# EAGLE design mainboard (EAGLE 7.7.0)
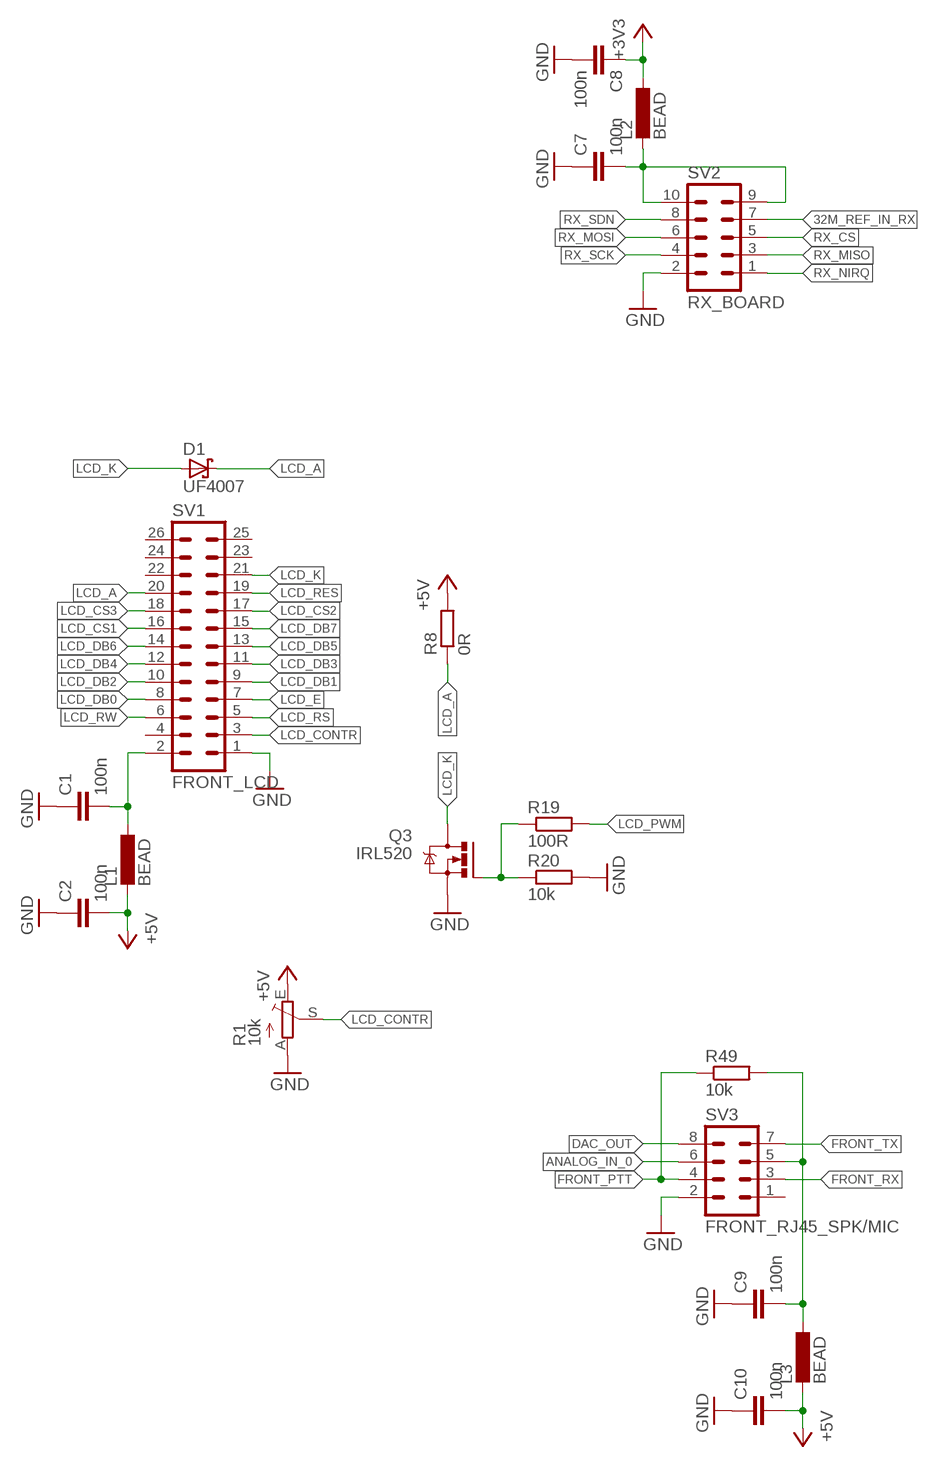
[diagram p0: schematic, sheet 1, part 1 of 3]
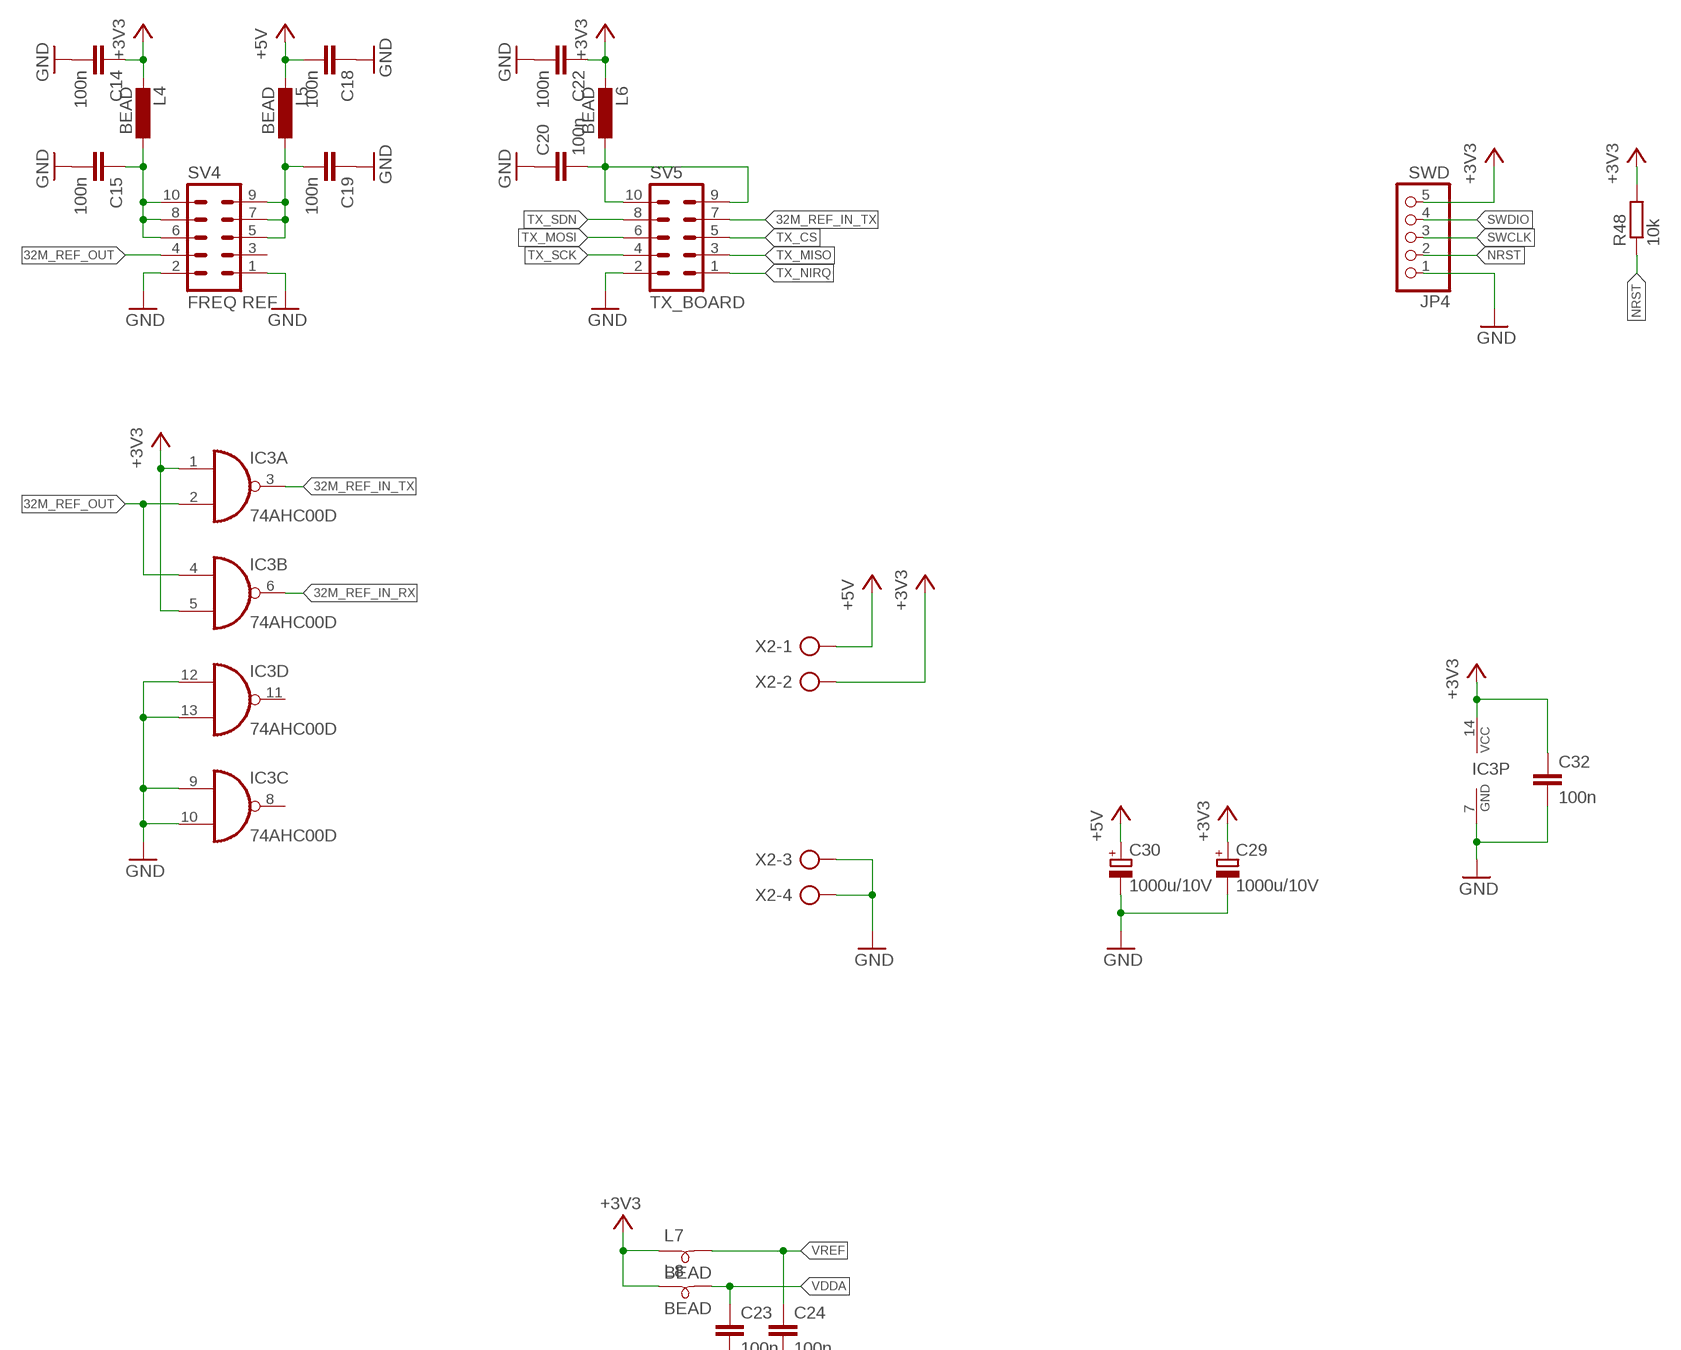
[diagram p1: schematic, sheet 1, part 2 of 3]
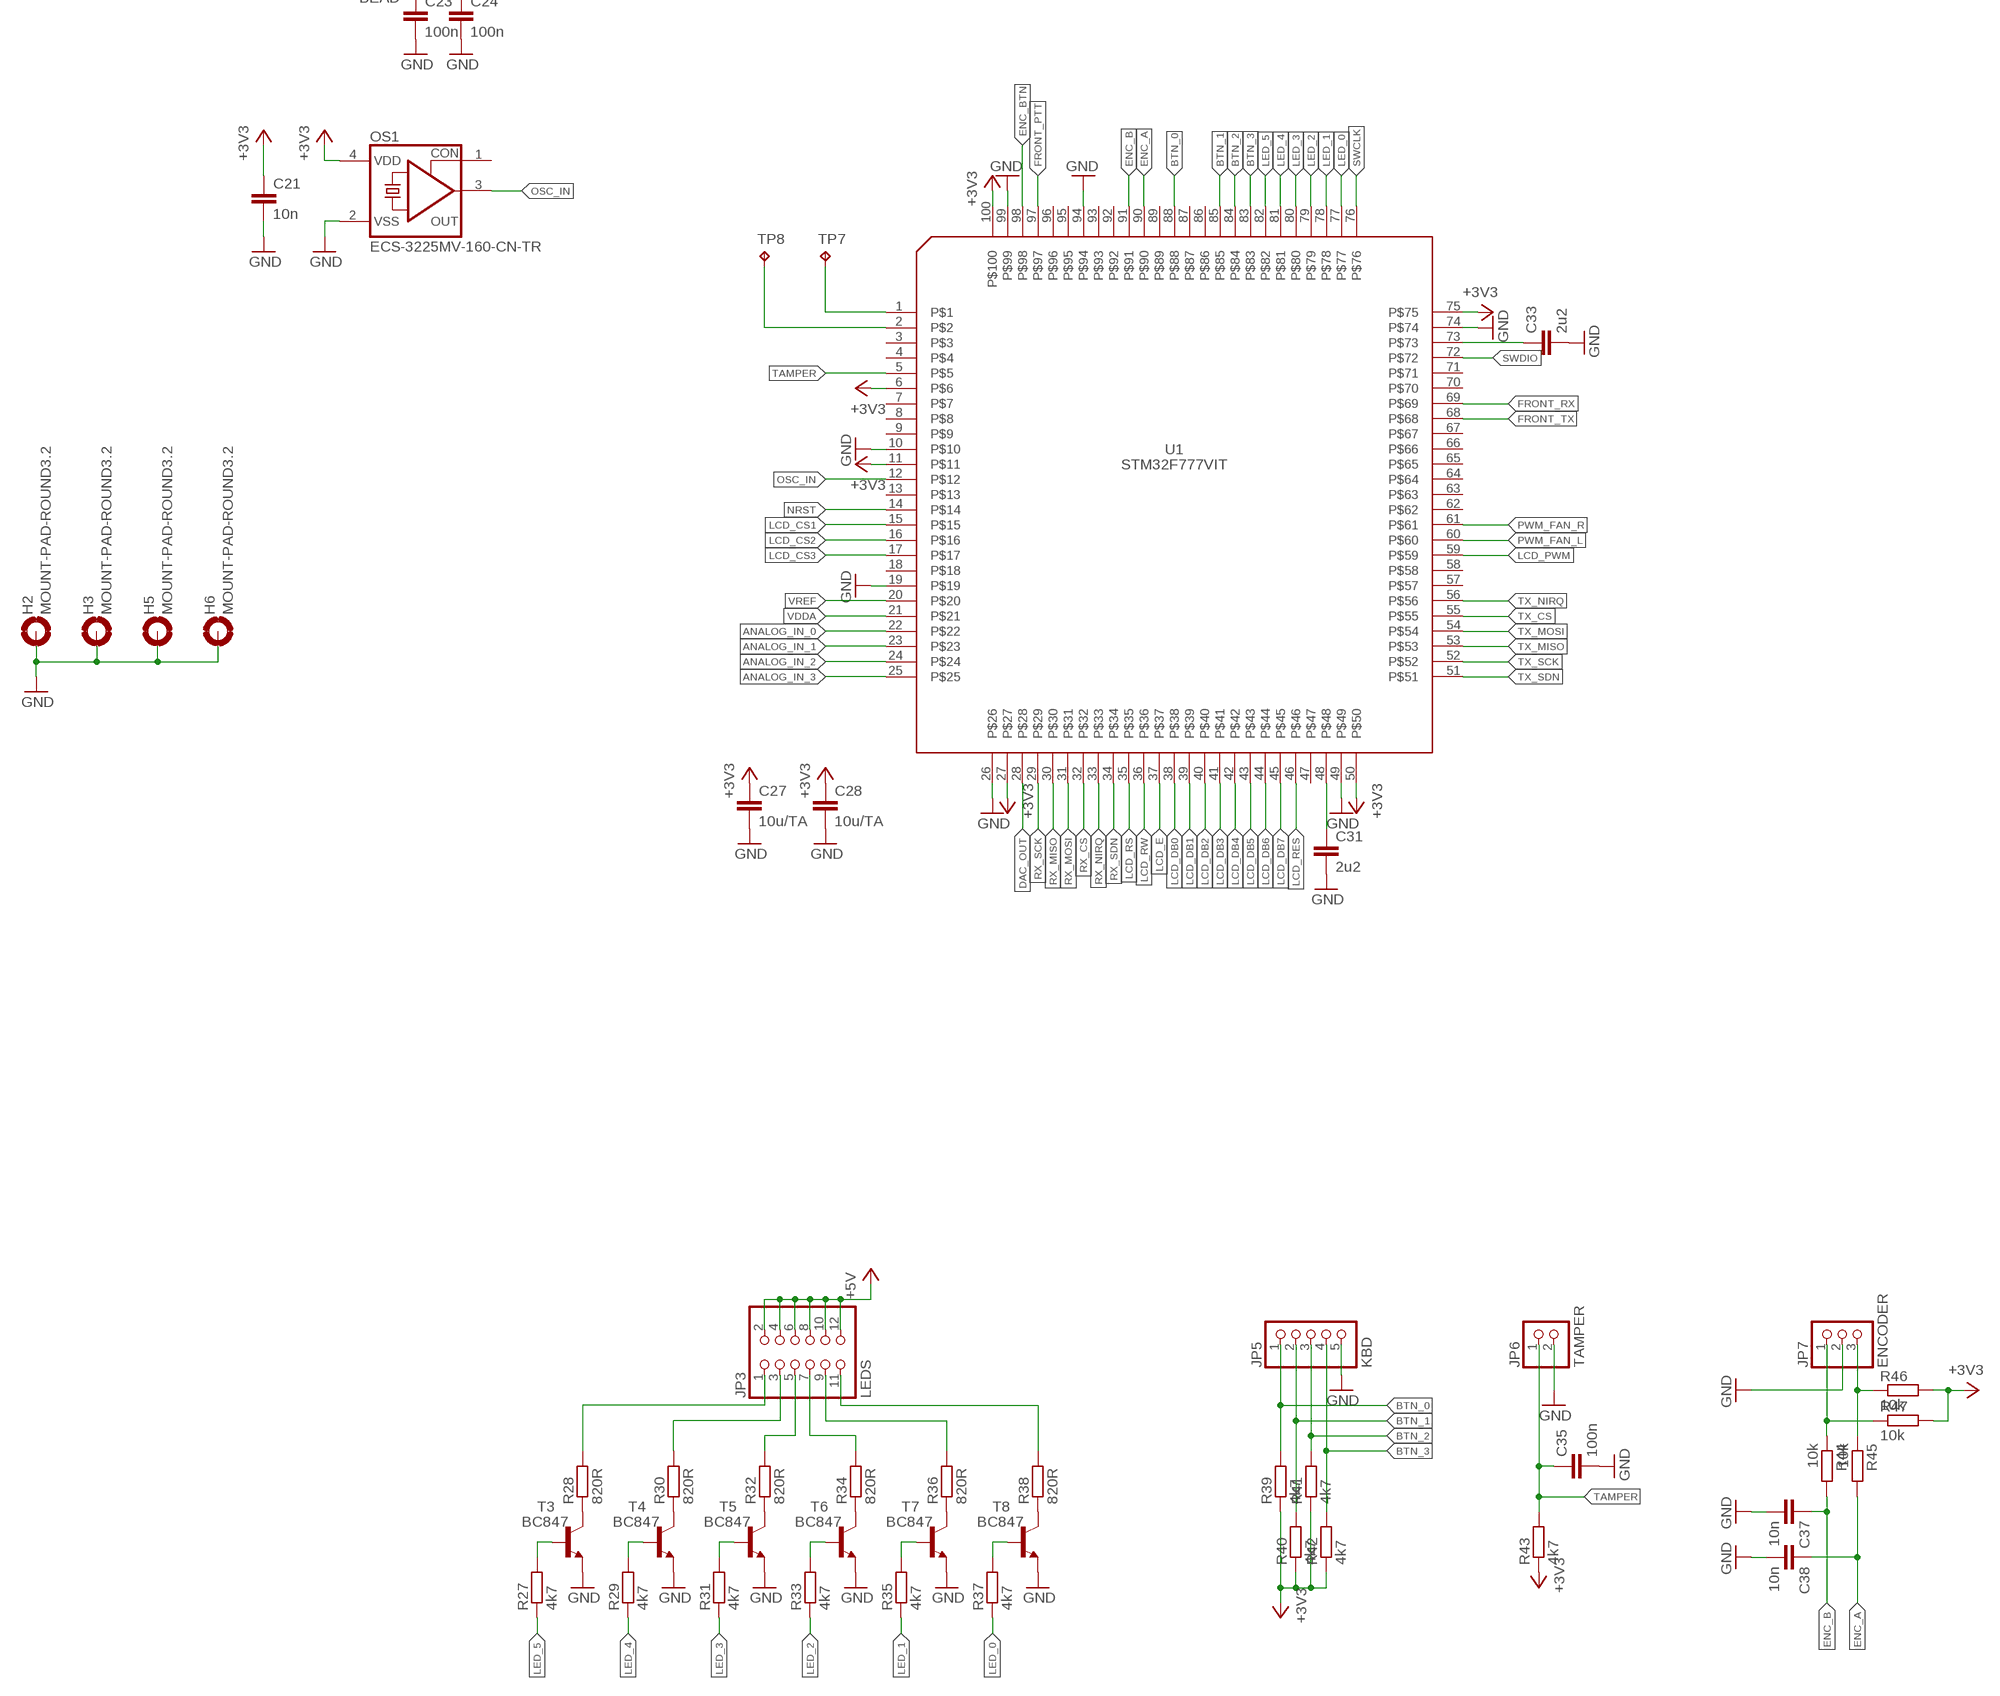
[diagram p2: schematic, sheet 1, part 3 of 3]

## Parts
C1  100n  C-EUC0805  [C0805]
C2  100n  C-EUC0805  [C0805]
C7  100n  C-EUC0805  [C0805]
C8  100n  C-EUC0805  [C0805]
C9  100n  C-EUC0805  [C0805]
C10  100n  C-EUC0805  [C0805]
C14  100n  C-EUC0805  [C0805]
C15  100n  C-EUC0805  [C0805]
C18  100n  C-EUC0805  [C0805]
C19  100n  C-EUC0805  [C0805]
C20  100n  C-EUC0805  [C0805]
C21  10n  C-EUC0805  [C0805]
C22  100n  C-EUC0805  [C0805]
C23  100n  C-EUC0805  [C0805]
C24  100n  C-EUC0805  [C0805]
C27  10u/TA  C-EUC1206  [C1206]
C28  10u/TA  C-EUC1206  [C1206]
C29  1000u/10V  CPOL-EUE3.5-8  [E3,5-8]
C30  1000u/10V  CPOL-EUE3.5-8  [E3,5-8]
C31  2u2  C-EUC0805  [C0805]
C32  100n  C-EUC0805  [C0805]
C33  2u2  C-EUC0805  [C0805]
C35  100n  C-EUC0805  [C0805]
C37  10n  C-EUC0805  [C0805]
C38  10n  C-EUC0805  [C0805]
D1  UF4007  1N5819-T  [DO41-7.6]
H2  MOUNT-PAD-ROUND3.2  [3,2-PAD]
H3  MOUNT-PAD-ROUND3.2  [3,2-PAD]
H5  MOUNT-PAD-ROUND3.2  [3,2-PAD]
H6  MOUNT-PAD-ROUND3.2  [3,2-PAD]
IC3  74AHC00D  7400D  [SO14]
JP3  LEDS  PINHD-2X6  [2X06]
JP4  SWD  PINHD-1X5  [1X05]
JP5  KBD  PINHD-1X5  [1X05]
JP6  TAMPER  PINHD-1X2  [1X02]
JP7  ENCODER  PINHD-1X3  [1X03]
L1  BEAD  L-EU0204/7  [0204/7]
L2  BEAD  L-EU0204/7  [0204/7]
L3  BEAD  L-EU0204/7  [0204/7]
L4  BEAD  L-EU0204/7  [0204/7]
L5  BEAD  L-EU0204/7  [0204/7]
L6  BEAD  L-EU0204/7  [0204/7]
L7  BEAD  SM-B5  [SM-B5]
L8  BEAD  SM-B5  [SM-B5]
OS1  ECS-3225MV-160-CN-TR  OSC-OE-CFPS-39  [3.4X2.7-4-PAD]
Q3  IRL520  IRF540  [TO220BV]
R1  10k  TRIM_EU-CA6V  [CA6V]
R8  0R  R-EU_R1206  [R1206]
R19  100R  R-EU_R0805  [R0805]
R20  10k  R-EU_R0805  [R0805]
R27  4k7  R-EU_R0805  [R0805]
R28  820R  R-EU_R0805  [R0805]
R29  4k7  R-EU_R0805  [R0805]
R30  820R  R-EU_R0805  [R0805]
R31  4k7  R-EU_R0805  [R0805]
R32  820R  R-EU_R0805  [R0805]
R33  4k7  R-EU_R0805  [R0805]
R34  820R  R-EU_R0805  [R0805]
R35  4k7  R-EU_R0805  [R0805]
R36  820R  R-EU_R0805  [R0805]
R37  4k7  R-EU_R0805  [R0805]
R38  820R  R-EU_R0805  [R0805]
R39  4k7  R-EU_R0805  [R0805]
R40  4k7  R-EU_R0805  [R0805]
R41  4k7  R-EU_R0805  [R0805]
R42  4k7  R-EU_R0805  [R0805]
R43  4k7  R-EU_R0805  [R0805]
R44  10k  R-EU_R0805  [R0805]
R45  10k  R-EU_R0805  [R0805]
R46  10k  R-EU_R0805  [R0805]
R47  10k  R-EU_R0805  [R0805]
R48  10k  R-EU_R0805  [R0805]
R49  10k  R-EU_R0805  [R0805]
SV1  FRONT_LCD  ML26  [ML26]
SV2  RX_BOARD  ML10  [ML10]
SV3  FRONT_RJ45_SPK/MIC  MA04-2  [MA04-2]
SV4  FREQ REF  ML10  [ML10]
SV5  TX_BOARD  ML10  [ML10]
T3  BC847  [SOT23]
T4  BC847  [SOT23]
T5  BC847  [SOT23]
T6  BC847  [SOT23]
T7  BC847  [SOT23]
T8  BC847  [SOT23]
TP7  TPB2,54  [B2,54]
TP8  TPB2,54  [B2,54]
U1  STM32F777VIT  [LQFP100]
X2  AK500/4  [AK500/4]

## Nets
32M_REF_IN_RX: IC3.6(B:O) SV2.7
32M_REF_IN_TX: IC3.3(A:O) SV5.7
32M_REF_OUT: IC3.2(A:I1) IC3.4(B:I0) SV4.4
+3V3: C8.1 C14.1 C21.1 C22.1 C27.1 C28.1 C29.+ C32.1 IC3.1(A:I0) IC3.5(B:I1) IC3.14(P:VCC) JP4.5 L2.1 L4.2 L6.2 L7.1 L8.1 OS1.4(VDD) R39.1 R40.1 R41.1 R42.1 R43.1 R46.2 R47.2 R48.2 U1.6 U1.11 U1.27 U1.50 U1.75 U1.100 X2.2
+5V: C2.2 C10.2 C18.2 C30.+ JP3.2 JP3.4 JP3.6 JP3.8 JP3.10 JP3.12 L1.2 L3.2 L5.2 R1.E R8.2 X2.1
ANALOG_IN_0: SV3.6 U1.22
ANALOG_IN_1: U1.23
ANALOG_IN_2: U1.24
ANALOG_IN_3: U1.25
BTN_0: JP5.1 R39.2 U1.88
BTN_1: JP5.2 R40.2 U1.85
BTN_2: JP5.3 R41.2 U1.84
BTN_3: JP5.4 R42.2 U1.83
DAC_OUT: SV3.8 U1.28
ENC_A: C38.1 R45.2 U1.90
ENC_B: C37.1 R44.2 U1.91
ENC_BTN: U1.98
FRONT_PTT: R49.1 SV3.4 U1.97
FRONT_RX: SV3.3 U1.69
FRONT_TX: SV3.7 U1.68
GND: C1.1 C2.1 C7.1 C8.2 C9.1 C10.1 C14.2 C15.2 C18.1 C19.1 C20.1 C21.2 C22.2 C23.2 C24.2 C27.2 C28.2 C29.- C30.- C31.2 C32.2 C33.2 C35.2 C37.2 C38.2 H2.B3,2(MOUNT) H3.B3,2(MOUNT) H5.B3,2(MOUNT) H6.B3,2(MOUNT) IC3.7(P:GND) IC3.9(C:I0) IC3.10(C:I1) IC3.12(D:I0) IC3.13(D:I1) JP4.1 JP5.5 JP6.2 JP7.2 OS1.2(VSS) Q3.S R1.A R20.2 SV1.1 SV2.2 SV3.2 SV4.1 SV4.2 SV5.2 T3.2(E) T4.2(E) T5.2(E) T6.2(E) T7.2(E) T8.2(E) U1.10 U1.19 U1.26 U1.49 U1.74 U1.94 U1.99 X2.3 X2.4
LCD_A: D1.C R8.1 SV1.20
LCD_CONTR: R1.S SV1.3
LCD_CS1: SV1.16 U1.15
LCD_CS2: SV1.17 U1.16
LCD_CS3: SV1.18 U1.17
LCD_DB0: SV1.8 U1.38
LCD_DB1: SV1.9 U1.39
LCD_DB2: SV1.10 U1.40
LCD_DB3: SV1.11 U1.41
LCD_DB4: SV1.12 U1.42
LCD_DB5: SV1.13 U1.43
LCD_DB6: SV1.14 U1.44
LCD_DB7: SV1.15 U1.45
LCD_E: SV1.7 U1.37
LCD_K: D1.A Q3.D SV1.21
LCD_PWM: R19.2 U1.59
LCD_RES: SV1.19 U1.46
LCD_RS: SV1.5 U1.35
LCD_RW: SV1.6 U1.36
LED_0: R37.1 U1.77
LED_1: R35.1 U1.78
LED_2: R33.1 U1.79
LED_3: R31.1 U1.80
LED_4: R29.1 U1.81
LED_5: R27.1 U1.82
N$2: Q3.G R19.1 R20.1
N$4: C15.1 L4.1 SV4.6 SV4.8 SV4.10
N$5: C19.2 L5.1 SV4.5 SV4.7 SV4.9
N$6: C20.2 L6.1 SV5.9 SV5.10
N$7: C1.2 L1.1 SV1.2
N$8: C7.2 L2.2 SV2.9 SV2.10
N$13: C9.2 L3.1 R49.2 SV3.5
N$24: C31.1 U1.48
N$25: C33.1 U1.73
N$28: R27.2 T3.1(B)
N$29: R28.1 T3.3(C)
N$30: JP3.1 R28.2
N$31: JP3.3 R30.2
N$32: R29.2 T4.1(B)
N$33: R30.1 T4.3(C)
N$34: JP3.5 R32.2
N$35: R31.2 T5.1(B)
N$36: R32.1 T5.3(C)
N$37: JP3.7 R34.2
N$38: R33.2 T6.1(B)
N$39: R34.1 T6.3(C)
N$40: JP3.9 R36.2
N$41: R35.2 T7.1(B)
N$42: R36.1 T7.3(C)
N$43: JP3.11 R38.2
N$44: R37.2 T8.1(B)
N$46: R38.1 T8.3(C)
N$47: TP7.TP U1.1
N$48: JP7.3 R45.1 R46.1
N$49: JP7.1 R44.1 R47.1
N$50: TP8.TP U1.2
NRST: JP4.2 R48.1 U1.14
OSC_IN: OS1.3(OUT) U1.12
PWM_FAN_L: U1.60
PWM_FAN_R: U1.61
RX_CS: SV2.5 U1.32
RX_MISO: SV2.3 U1.30
RX_MOSI: SV2.6 U1.31
RX_NIRQ: SV2.1 U1.33
RX_SCK: SV2.4 U1.29
RX_SDN: SV2.8 U1.34
SWCLK: JP4.3 U1.76
SWDIO: JP4.4 U1.72
TAMPER: C35.1 JP6.1 R43.2 U1.5
TX_CS: SV5.5 U1.55
TX_MISO: SV5.3 U1.53
TX_MOSI: SV5.6 U1.54
TX_NIRQ: SV5.1 U1.56
TX_SCK: SV5.4 U1.52
TX_SDN: SV5.8 U1.51
VDDA: C23.1 L8.2 U1.21
VREF: C24.1 L7.2 U1.20
Unconnected: IC3.8(C:O) IC3.11(D:O) OS1.1(CON) SV1.4 SV1.22 SV1.23 SV1.24 SV1.25 SV1.26 SV3.1 SV4.3 U1.3 U1.4 U1.7 U1.8 U1.9 U1.13 U1.18 U1.47 U1.57 U1.58 U1.62 U1.63 U1.64 U1.65 U1.66 U1.67 U1.70 U1.71 U1.86 U1.87 U1.89 U1.92 U1.93 U1.95 U1.96

## Library data of the parts
C1 C2 C7-C10 C14 C15 C18-C24 C31-C33 C35 C37 C38 = rcl:C-EU: CAPACITOR, European symbol
C27 C28 = resistor:C-EU: CAPACITOR, European symbol
C29 C30 = rcl:CPOL-EU: POLARIZED CAPACITOR, European symbol
D1 = diode:1N581*: 1.0A SCHOTTKY BARRIER RECTIFIER Source: http://www.diodes.com/datasheets/ds23001.pdf
H2 H3 H5 H6 = holes:MOUNT-PAD-ROUND: MOUNTING PAD, round
IC3 = 74xx-eu:74*00: Quad 2-input NAND gate
JP3 = pinhead:PINHD-2X6: PIN HEADER
JP4 JP5 = pinhead:PINHD-1X5: PIN HEADER
JP6 = pinhead:PINHD-1X2: PIN HEADER
JP7 = pinhead:PINHD-1X3: PIN HEADER
L1-L6 = rcl:L-EU: INDUCTOR, European symbol
L7 L8 = inductor-neosid:SM-B: INDUCTOR SMD Bead inductor; OC_FARNELL: unknown; OC_NEWARK: unknown
OS1 = IQD-Frequency-Products:OSC-OE: OSCILLATOR WITH OE
Q3 = transistor-power:IRF540: HEXFET Power MOSFET
R1 = pot:TRIM_EU-: POTENTIOMETER
R8 R44-R47 = rcl:R-EU_: RESISTOR, European symbol
R19 R20 R27-R43 R48 R49 = resistor:R-EU_: RESISTOR, European symbol
SV1 = con-harting-ml:ML26: HARTING; OC_FARNELL: unknown; OC_NEWARK: unknown
SV2 SV4 SV5 = con-harting-ml:ML10: HARTING; OC_FARNELL: unknown; OC_NEWARK: unknown
SV3 = con-lstb:MA04-2: PIN HEADER; OC_FARNELL: unknown; OC_NEWARK: unknown
T3-T8 = transistor:BC847: NPN TRANSISTOR
TP7 TP8 = testpad:TP: Test pad
U1 = micro-stm_v3:STM32F777VIT
X2 = con-ptr500:AK500/4: CONNECTOR; OC_FARNELL: unknown; OC_NEWARK: unknown

## Net classes
1 pwr: width 0.5 mm, drill 0.2 mm, clearance 0.127 mm

## Board
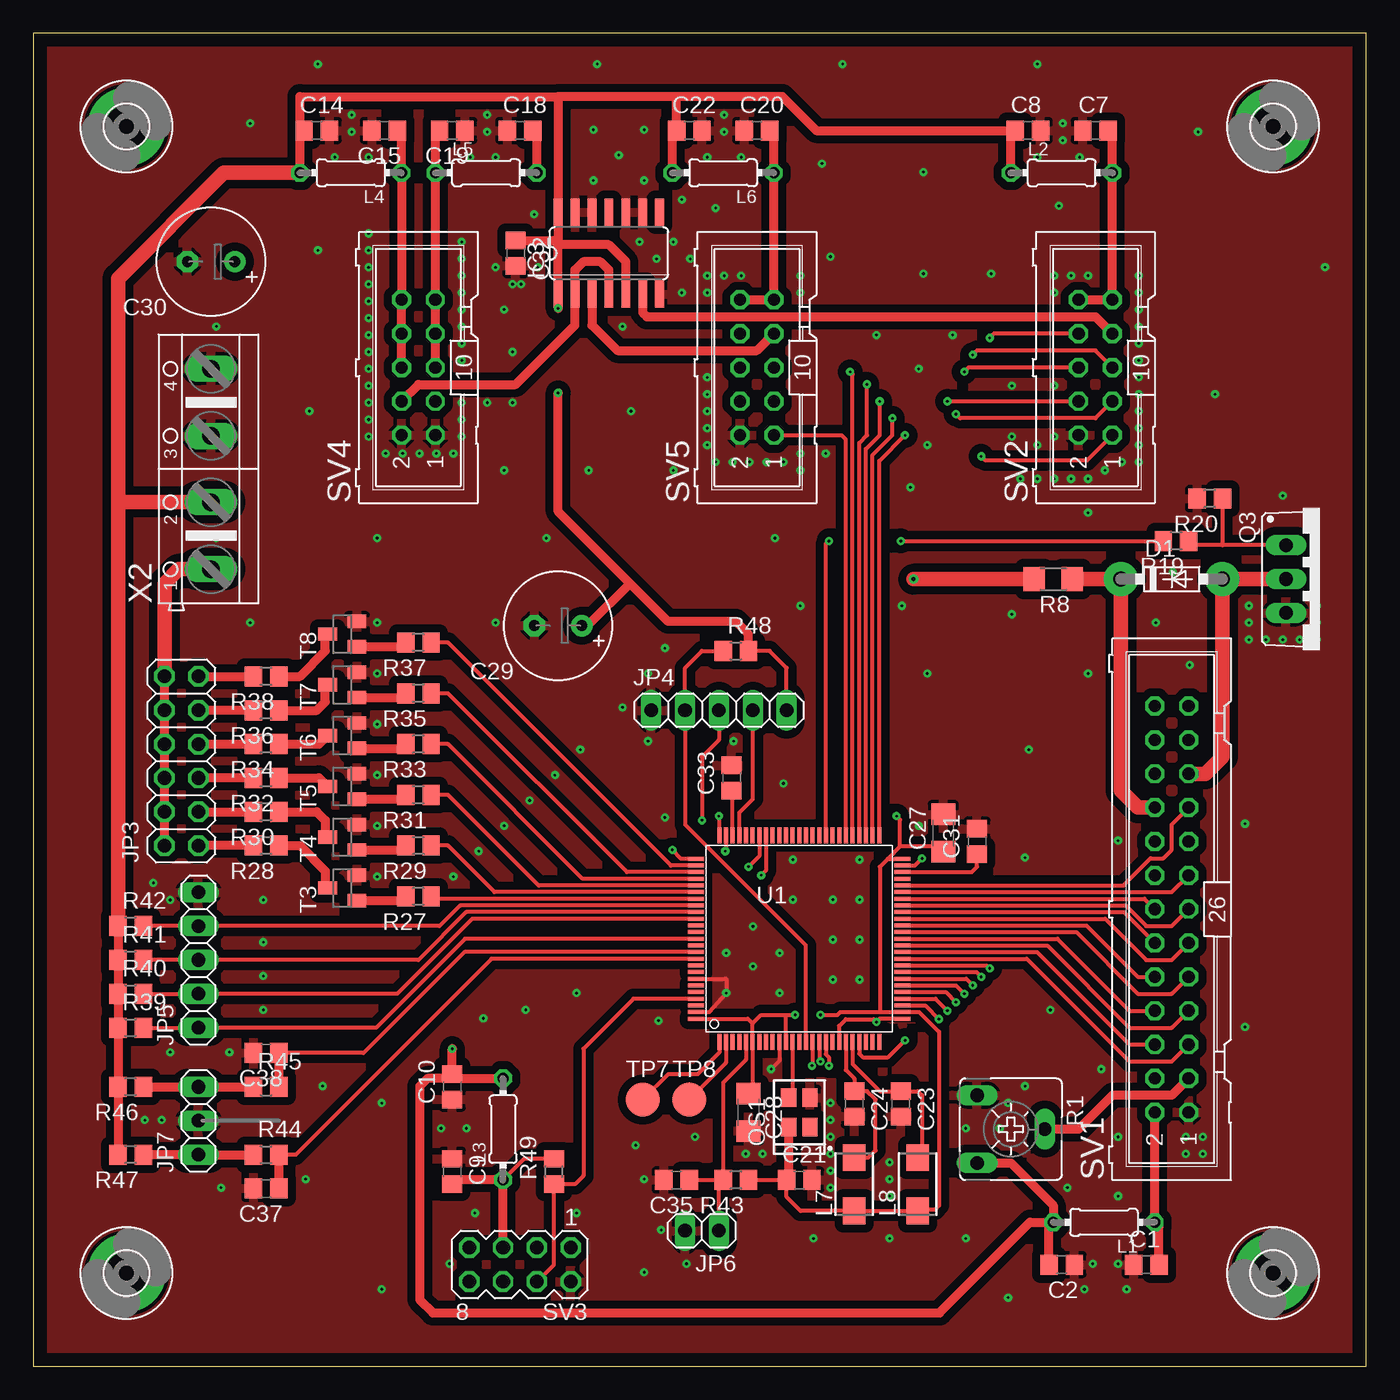
[diagram p3: board, top side]
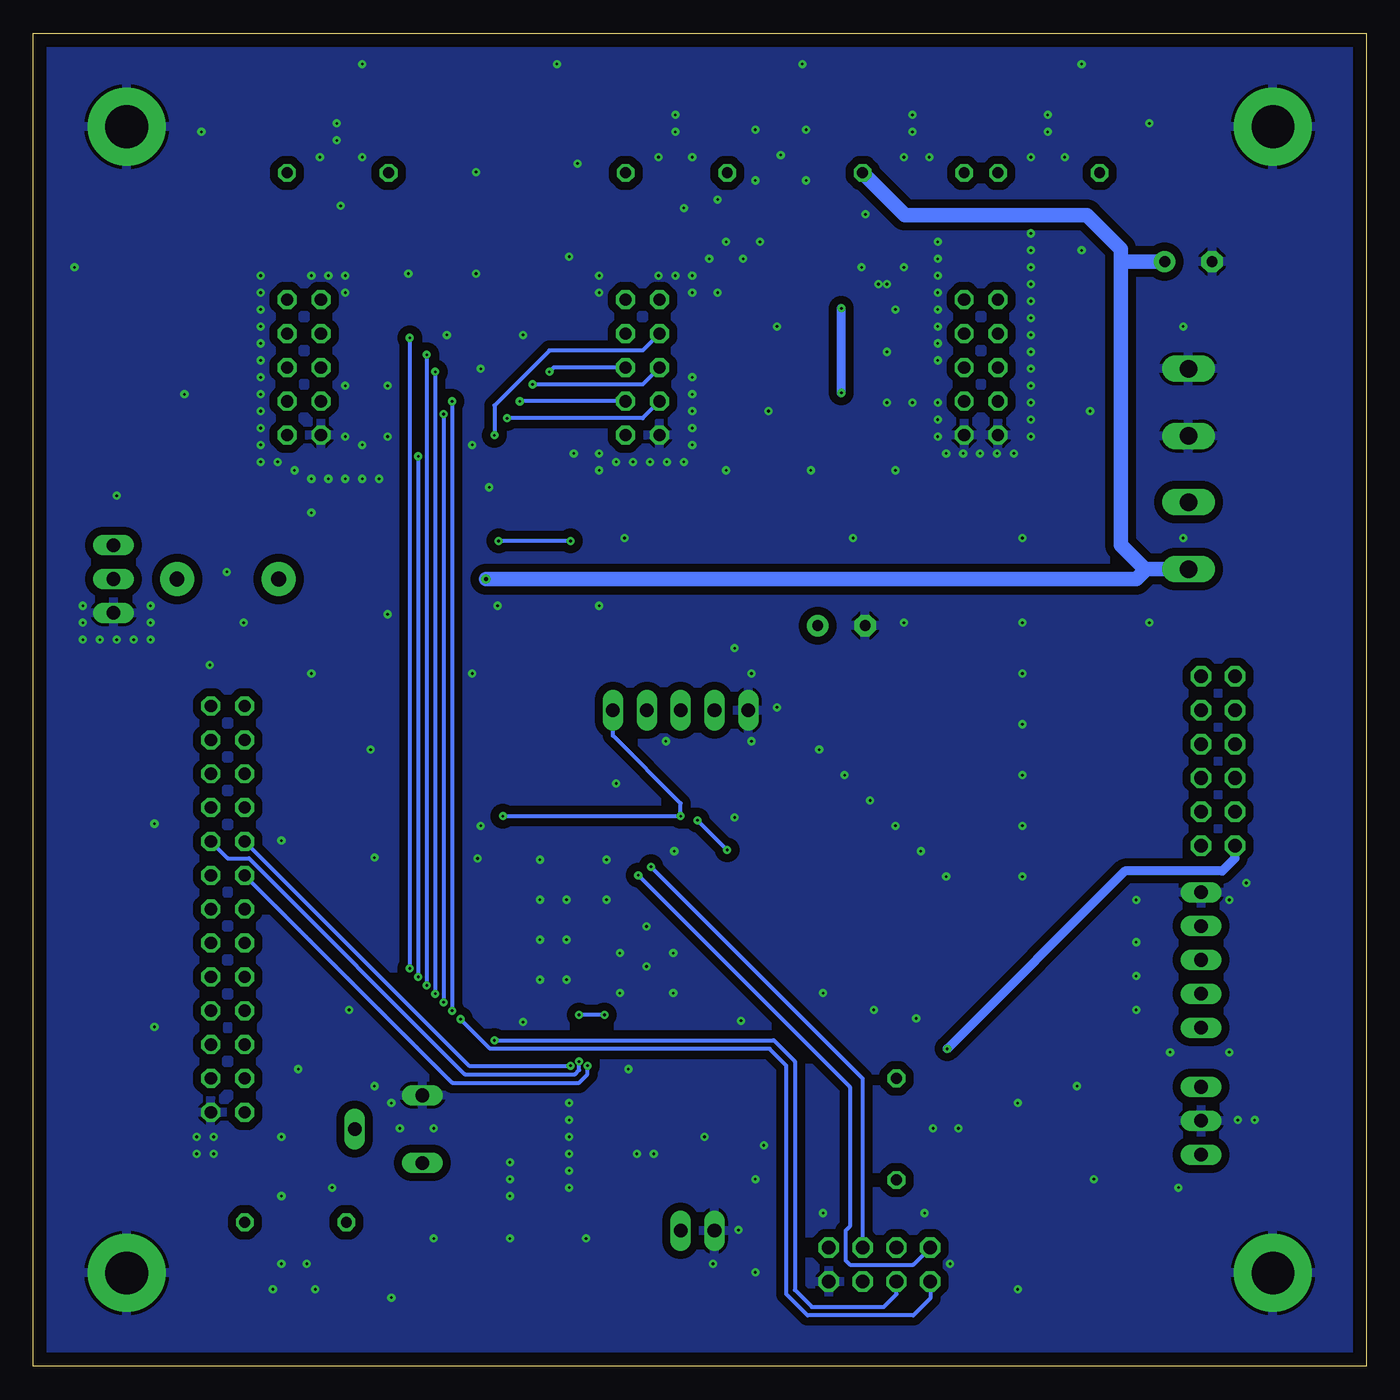
[diagram p4: board, bottom side, seen from below]

Size 100 x 100 mm. Coordinates in mm from the lower left corner, seen from the top.
Outline: 0,0 100,0 100,100 0,100 0,0
Copper layers (1*16): Top 0.035mm / dielectric 1.5mm / Bottom 0.035mm
Design rules "default *": minimum track width 10mil, minimum drill 24mil, track to track 8mil, track to pad 8mil, pad to pad 8mil, via to via 8mil, smd to smd 8mil, copper to edge 40mil, drill to drill 8mil, minimum pad ring 10mil, minimum via ring 8mil, stop-mask expansion 4mil, vias tented up to drill 0.5mm, thermal gap 10mil

### Footprints (pad centres in the part's own frame; a part is rotated, then mirrored left to right if it is on the bottom)
C0805 = smd 1.3 x 1.5: 1 -0.95,0; 2 0.95,0
C1206 = smd 1.6 x 1.8: 1 -1.4,0; 2 1.4,0
E3,5-8 = drill 0.813 pad 1.6: + -1.778,0 | drill 0.813 pad 1.6 octagon: - 1.778,0
DO41-7.6 = drill 1.1 pad 2.54: A 3.81,0; C -3.81,0
3,2-PAD = drill 3.2 pad 5.842: B3,2 0,0
SO14 = smd 0.66 x 2.032: 1 -3.81,-3.073; 2 -2.54,-3.073; 3 -1.27,-3.073; 4 0,-3.073; 5 1.27,-3.073; 6 2.54,-3.073; 7 3.81,-3.073; 8 3.81,3.073; 9 2.54,3.073; 10 1.27,3.073; 11 0,3.073; 12 -1.27,3.073; 13 -2.54,3.073; 14 -3.81,3.073
2X06 = drill 1.016 octagon: 1 -6.35,-1.27; 2 -6.35,1.27; 3 -3.81,-1.27; 4 -3.81,1.27; 5 -1.27,-1.27; 6 -1.27,1.27; 7 1.27,-1.27; 8 1.27,1.27; 9 3.81,-1.27; 10 3.81,1.27; 11 6.35,-1.27; 12 6.35,1.27
1X05 = drill 1.016 long: 1 -5.08,0; 2 -2.54,0; 3 0,0; 4 2.54,0; 5 5.08,0
1X02 = drill 1.016 long: 1 -1.27,0; 2 1.27,0
1X03 = drill 1.016 long: 1 -2.54,0; 2 0,0; 3 2.54,0
0204/7 = drill 0.813 octagon: 1 -3.81,0; 2 3.81,0
SM-B5 = smd 2 x 1.7: 1 -2,0; 2 2,0
3.4X2.7-4-PAD = smd 1.4 x 1.15: 1 -1.1,-0.8; 2 1.1,-0.8; 3 1.1,0.8; 4 -1.1,0.8
TO220BV = drill 1.016 long: D 0,-2.54; G -2.54,-2.54; S 2.54,-2.54
CA6V = drill 1.016 long: A -2.54,-2.54; E 2.54,-2.54; S 0,2.54
R1206 = smd 1.6 x 1.803: 1 -1.422,0; 2 1.422,0
R0805 = smd 1.3 x 1.5: 1 -0.95,0; 2 0.95,0
ML26 = drill 0.914 octagon: 1 -15.24,-1.27; 2 -15.24,1.27; 3 -12.7,-1.27; 4 -12.7,1.27; 5 -10.16,-1.27; 6 -10.16,1.27; 7 -7.62,-1.27; 8 -7.62,1.27; 9 -5.08,-1.27; 10 -5.08,1.27; 11 -2.54,-1.27; 12 -2.54,1.27; 13 0,-1.27; 14 0,1.27; 15 2.54,-1.27; 16 2.54,1.27; 17 5.08,-1.27; 18 5.08,1.27; 19 7.62,-1.27; 20 7.62,1.27; 21 10.16,-1.27; 22 10.16,1.27; 23 12.7,-1.27; 24 12.7,1.27; 25 15.24,-1.27; 26 15.24,1.27
ML10 = drill 0.914 octagon: 1 -5.08,-1.27; 2 -5.08,1.27; 3 -2.54,-1.27; 4 -2.54,1.27; 5 0,-1.27; 6 0,1.27; 7 2.54,-1.27; 8 2.54,1.27; 9 5.08,-1.27; 10 5.08,1.27
MA04-2 = drill 1.016 octagon: 1 -3.81,-1.27; 2 -3.81,1.27; 3 -1.27,-1.27; 4 -1.27,1.27; 5 1.27,-1.27; 6 1.27,1.27; 7 3.81,-1.27; 8 3.81,1.27
SOT23 = smd 1 x 1.4: 1 -0.95,-1.1; 2 0.95,-1.1; 3 0,1.1
B2,54 = smd 2.54 x 2.54: TP 0,0
LQFP100 = smd 0.3 x 1.2: 1 -6,-7.75; 2 -5.5,-7.75; 3 -5,-7.75; 4 -4.5,-7.75; 5 -4,-7.75; 6 -3.5,-7.75; 7 -3,-7.75; 8 -2.5,-7.75; 9 -2,-7.75; 10 -1.5,-7.75; 11 -1,-7.75; 12 -0.5,-7.75; 13 0,-7.75; 14 0.5,-7.75; 15 1,-7.75; 16 1.5,-7.75; 17 2,-7.75; 18 2.5,-7.75; 19 3,-7.75; 20 3.5,-7.75; 21 4,-7.75; 22 4.5,-7.75; 23 5,-7.75; 24 5.5,-7.75; 25 6,-7.75; 51 6,7.75; 52 5.5,7.75; 53 5,7.75; 54 4.5,7.75; 55 4,7.75; 56 3.5,7.75; 57 3,7.75; 58 2.5,7.75; 59 2,7.75; 60 1.5,7.75; 61 1,7.75; 62 0.5,7.75; 63 0,7.75; 64 -0.5,7.75; 65 -1,7.75; 66 -1.5,7.75; 67 -2,7.75; 68 -2.5,7.75; 69 -3,7.75; 70 -3.5,7.75; 71 -4,7.75; 72 -4.5,7.75; 73 -5,7.75; 74 -5.5,7.75; 75 -6,7.75 | smd 1.2 x 0.3: 26 7.75,-6; 27 7.75,-5.5; 28 7.75,-5; 29 7.75,-4.5; 30 7.75,-4; 31 7.75,-3.5; 32 7.75,-3; 33 7.75,-2.5; 34 7.75,-2; 35 7.75,-1.5; 36 7.75,-1; 37 7.75,-0.5; 38 7.75,0; 39 7.75,0.5; 40 7.75,1; 41 7.75,1.5; 42 7.75,2; 43 7.75,2.5; 44 7.75,3; 45 7.75,3.5; 46 7.75,4; 47 7.75,4.5; 48 7.75,5; 49 7.75,5.5; 50 7.75,6; 76 -7.75,6; 77 -7.75,5.5; 78 -7.75,5; 79 -7.75,4.5; 80 -7.75,4; 81 -7.75,3.5; 82 -7.75,3; 83 -7.75,2.5; 84 -7.75,2; 85 -7.75,1.5; 86 -7.75,1; 87 -7.75,0.5; 88 -7.75,0; 89 -7.75,-0.5; 90 -7.75,-1; 91 -7.75,-1.5; 92 -7.75,-2; 93 -7.75,-2.5; 94 -7.75,-3; 95 -7.75,-3.5; 96 -7.75,-4; 97 -7.75,-4.5; 98 -7.75,-5; 99 -7.75,-5.5; 100 -7.75,-6
AK500/4 = drill 1.321 long: 1 -7.518,0; 2 -2.489,0; 3 2.489,0; 4 7.518,0

### Placement (x,y rotation side)
C1  83.5,7.62 0 top
C2  77.15,7.62 180 top
C7  79.69,92.71 0 top
C8  74.61,92.71 0 top
C9  31.43,14.61 270 top
C10  31.43,20.95 90 top
C14  21.27,92.71 0 top
C15  26.35,92.71 180 top
C18  36.51,92.71 0 top
C19  31.43,92.71 180 top
C20  54.29,92.71 0 top
C21  57.47,13.97 0 top
C22  49.21,92.71 0 top
C23  65.09,19.68 270 top
C24  61.59,19.68 270 top
C27  68.26,40.01 90 top
C28  53.66,19.05 270 top
C29  39.37,55.56 180 top
C30  13.34,82.87 180 top
C31  70.8,39.37 90 top
C32  36.2,83.5 270 top
C33  52.39,44.13 90 top
C35  48.26,13.97 180 top
C37  17.46,13.34 180 top
C38  17.46,23.5 180 top
D1  85.41,59.05 0 top
H2  93,7 0 top
H3  93,93 0 top
H5  7,93 0 top
H6  7,7 0 top
IC3  43.18,83.5 0 top
JP3  11.11,45.4 90 top
JP4  51.44,49.21 0 top
JP5  12.38,30.48 90 top
JP6  50.16,10.16 180 top
JP7  12.38,18.41 90 top
L1  80.33,10.79 180 top
L2  77.15,89.53 0 top
L3  35.24,17.78 90 top
L4  23.81,89.53 180 top
L5  33.97,89.53 0 top
L6  51.75,89.53 180 top
L7  61.59,13.65 90 top
L8  66.36,13.65 90 top
OS1  57.47,19.05 90 top
Q3  96.52,59.05 270 top
R1  73.34,17.78 270 top
R8  76.52,59.05 180 top
R19  85.72,61.91 180 top
R20  88.27,65.09 180 top
R27  28.89,35.24 180 top
R28  17.46,39.05 180 top
R29  28.89,39.05 180 top
R30  17.46,41.59 180 top
R31  28.89,42.86 180 top
R32  17.46,44.13 180 top
R33  28.89,46.67 180 top
R34  17.46,46.67 180 top
R35  28.89,50.48 180 top
R36  17.46,49.21 180 top
R37  28.89,54.29 180 top
R38  17.46,51.75 180 top
R39  7.3,25.4 0 top
R40  7.3,27.94 0 top
R41  7.3,30.48 0 top
R42  7.3,33.02 0 top
R43  52.7,13.97 180 top
R44  17.46,15.88 0 top
R45  17.46,20.95 0 top
R46  7.3,20.95 180 top
R47  7.3,15.88 180 top
R48  52.7,53.66 0 top
R49  39.05,14.61 90 top
SV1  85.41,34.29 90 top
SV2  79.69,74.93 90 top
SV3  36.51,7.62 180 top
SV4  28.89,74.93 90 top
SV5  54.29,74.93 90 top
T3  23.18,35.88 90 top
T4  23.18,39.69 90 top
T5  23.18,43.5 90 top
T6  23.18,47.31 90 top
T7  23.18,51.12 90 top
T8  23.18,54.93 90 top
TP7  45.72,20 0 top
TP8  49.21,20 0 top
U1  57.47,32.07 0 top
X2  13.34,67.31 90 top

### Tracks (layer width: path | path; a pad name or v marks a point on that pad's centre or on a via)
32M_REF_IN_RX
  Top 0.66: IC3.6 45.72,79.06 46.04,78.74 79.69,78.74 SV2.7
32M_REF_IN_TX
  Top 0.66: IC3.3 41.91,78.11 43.81,76.2 54.29,76.2 SV5.7
32M_REF_OUT
  Top 0.66: IC3.4 43.18,82.23 42.55,82.87 41.27,82.87 40.64,82.23 IC3.2 40.64,78.11 36.2,73.66 28.89,73.66 SV4.4
+3V3  (via drill 0.2)
  Top 0.305: JP4.5 56.52,52.39 55.24,53.66 R48.2 | C27.1 67.72,38.07 67.72,39 65.03,39 | C28.1 53.97,20.76 U1.6 53.97,25.71 | U1.75 51.47,41.24 v51.44,41.27 | R43.1 C21.1 56.52,12.7 57.56,11.65 L7.1 L8.1 66.45,11.75 67.63,11.75 67.94,12.06 67.94,25.08 66.46,26.57 U1.27 63.5,26.57 | U1.11 56.47,26.3 56.52,26.35 | v59.05,26.35 60.33,26.35 60.54,26.57 63.5,26.57 | 64.1,38.07 63.5,37.47 63.5,26.57 | 64.1,38.07 U1.50 | 53.97,25.71 54.61,26.35 56.52,26.35 | 56.52,26.35 v57.15,26.35 | U1.100 53.61,26.07 53.97,25.71 | 65.03,39 64.1,38.07 | 65.03,39 65.03,41.01 v64.77,41.27
  Top 0.66: R47.2 R46.2 R39.1 R40.1 R41.1 R42.1 | L2.1 73.34,92.39 C8.1 58.74,92.71 56.2,95.25 48.26,95.25 | 39.37,84.14 IC3.14 39.37,95.25 | IC3.5 44.45,82.87 43.18,84.14 39.37,84.14 | C32.1 39.05,84.45 39.37,84.14 | OS1.4 56.67,14.12 C21.1 | 48.26,95.25 39.37,95.25 | 47.94,92.39 48.26,92.39 48.26,95.25 | L6.2 47.94,92.39 | 47.94,92.39 C22.1 | 20,92.39 20,95.25 39.37,95.25 | L4.2 20,92.39 | 20,92.39 C14.1 | 39.37,84.14 IC3.1 v39.37,79.38 | R48.2 53.66,54.93 52.7,55.88 47.62,55.88 44.77,58.74 | 44.77,58.74 39.37,64.14 v39.37,73.03 | C29.+ 41.59,55.56 44.77,58.74
  Top 1.1: R42.1 6.35,64.77 | 6.35,64.77 6.35,81.6 14.29,89.53 L4.2 | X2.2 6.4,64.82 6.35,64.77
  Bottom 0.305: JP4.5 56.52,47.31 51.44,42.23 v51.44,41.27 v64.77,41.27 | v57.15,26.35 v59.05,26.35
  Bottom 0.66: v39.37,73.03 v39.37,79.38
+5V  (via drill 0.2, 0.3)
  Top 0.66: JP3.2 JP3.4 JP3.6 JP3.8 JP3.10 JP3.12 | C2.2 76.2,10.47 L1.2 | R1.E 73.34,15.24 76.52,12.06 L1.2 | L5.2 37.78,92.39 C18.2 | 31.75,21.59 C10.2 v31.43,23.81 | 31.75,21.59 29.58,21.59 28.99,21 28.99,5 29.99,4 67.99,4 74.78,10.79 L1.2 | 31.75,21.59 L3.2
  Top 1.1: X2.1 10.9,59.79 9.84,58.74 JP3.12 | R8.2 v66.04,59.05
  Bottom 0.66: JP3.2 9.84,38.1 10.79,37.15 18.1,37.15 v31.43,23.81
  Bottom 1.1: X2.1 16.51,59.79 | 16.51,59.79 16.61,59.79 18.41,61.59 18.41,82.55 | 18.41,82.55 18.41,83.82 20.95,86.36 34.61,86.36 L5.2 | C30.+ 18.1,82.87 18.41,82.55 | v66.04,59.05 17.25,59.05 16.51,59.79
ANALOG_IN_0  (via drill 0.2)
  Top 0.305: U1.22 61.97,23.44 62.23,23.18 64.14,23.18 v65.41,24.45
  Bottom 0.305: v65.41,24.45 44.45,24.45 42.86,22.86 42.86,5.71 41.59,4.45 36.2,4.45 35.24,5.4 SV3.6
BTN_0
  Top 0.305: R39.2 JP5.1 25.72,25.4 32.38,32.07 U1.88
BTN_1
  Top 0.305: R40.2 JP5.2 27.3,27.94 32.93,33.57 U1.85
BTN_2
  Top 0.305: R41.2 JP5.3 28.89,30.48 32.48,34.07 U1.84
BTN_3
  Top 0.305: R42.2 JP5.4 30.48,33.02 32.03,34.57 U1.83
DAC_OUT  (via drill 0.2)
  Top 0.305: U1.28 66.91,27.07 v67.94,26.04
  Bottom 0.305: SV3.8 32.7,5.08 33.97,3.81 41.91,3.81 43.5,5.4 43.5,22.54 44.77,23.81 65.72,23.81 v67.94,26.04
ENC_A
  Top 0.305: U1.90 32.34,31.07 24.77,23.5 C38.1
  Top 0.66: C38.1 R45.2
ENC_B
  Top 0.305: U1.91 34.38,30.57 19.68,15.88 R44.2
  Top 0.66: R44.2 C37.1
FRONT_PTT
  Top 0.305: SV3.4 39.05,7.62 R49.1 40.64,13.65 41.27,14.29 41.27,23.81 45.03,27.57 U1.97
FRONT_RX  (via drill 0.2)
  Top 0.305: U1.69 54.47,38.27 v53.66,37.47
  Bottom 0.305: v53.66,37.47 37.78,21.59 SV3.3
FRONT_TX  (via drill 0.2)
  Top 0.305: U1.68 54.97,37.19 v54.61,36.83
  Bottom 0.305: v54.61,36.83 38.73,20.95 38.73,10.48 39.05,10.16 39.05,7.94 38.73,7.62 33.97,7.62 SV3.7
GND  (via drill 0.2)
  Top 0.305: U1.94 51.92,29.07 arc-90 51.99,29 v51.99,28 50.72,26.57 U1.99 | U1.49 66.14,37.57 v66.67,38.1 | U1.74 51.97,38.69 v51.91,38.63 | U1.10 55.97,22.9 v55.35,22.29 | U1.26 63.5,26.07 v63.26,25.82 63.05,26.04 60.96,26.04 60.47,25.54 U1.19
  other vias: 55.99,28 55.99,31 51.99,31 53.99,30 53.99,33 56.99,38 56.99,35 61.99,35 61.99,38 59.99,35 61.99,32 61.99,29 59.99,32 59.99,29 66.44,40.54 52.55,46.89 56.27,43.72 47.38,41.17 46.91,25.92 25.8,36.73 25.8,40.54 25.8,44.35 25.8,48.16 25.8,51.97 25.8,55.78 35.32,40.54 33.41,38.63 31.51,36.73 37.23,42.45 39.13,44.35 41.03,46.26 46.12,51.97 44.21,49.43 46.12,46.89 34.69,55.78 16.27,55.78 13.73,62.13 25.8,62.13 38.49,62.13 57.55,57.05 47.38,53.88 55.64,62.13 57.55,67.21 48.02,67.21 44.21,78 34.69,82.45 35.95,81.18 36.59,81.18 37.86,82.45 25.16,79.91 25.16,78.64 25.16,77.37 25.16,76.1 25.16,74.83 25.16,73.56 25.16,72.29 25.16,71.02 25.16,69.75 32.15,75.47 26.43,68.48 27.7,68.48 28.97,68.48 30.24,68.48 31.51,68.48 25.16,81.18 25.16,82.45 25.16,83.72 25.16,84.99 32.15,72.29 32.15,71.02 32.15,69.75 32.15,76.73 32.15,78 32.15,79.28 32.15,80.55 32.15,81.81 32.15,83.08 32.15,84.36 34.05,72.29 35.95,72.29 35.32,67.21 41.67,67.21 50.56,74.19 50.56,72.92 50.56,71.66 50.56,70.39 50.56,69.11 51.2,67.84 52.47,67.84 53.73,67.84 55.01,67.84 56.27,67.84 57.55,68.48 59.45,68.48 50.56,80.55 50.56,81.81 51.83,81.81 53.1,81.81 57.55,81.81 57.55,80.55 51.2,86.89 45.48,84.36 46.75,83.08 48.02,84.36 49.29,83.08 48.66,80.55 48.66,87.53 51.83,92.61 51.83,93.88 34.05,93.88 34.05,92.61 23.89,93.88 23.89,92.61 22.62,90.7 25.16,90.7 32.78,90.7 34.69,90.7 50.56,90.7 53.1,90.7 77.23,93.25 77.23,91.97 75.33,90.7 78.5,90.7 76.59,81.81 76.59,80.55 77.86,81.81 79.14,81.81 82.94,81.81 82.94,80.55 82.94,79.28 82.94,78 82.94,76.73 82.94,75.47 82.94,74.19 82.94,72.92 82.94,71.66 82.94,70.39 82.94,69.11 82.94,67.84 81.67,67.84 80.41,67.21 79.14,66.58 77.86,66.58 76.59,66.58 75.33,66.58 74.06,66.58 73.42,73.56 76.59,73.56 73.42,69.75 75.33,69.11 76.59,69.75 63.26,77.37 68.97,77.37 66.44,74.83 67.07,69.11 65.8,65.94 65.17,57.05 67.07,51.97 73.42,56.41 79.14,51.97 85.48,59.59 84.22,55.78 86.75,52.6 91.2,57.05 91.2,55.78 93.74,65.31 91.2,54.51 92.47,54.51 93.74,54.51 95.01,54.51 96.28,54.51 96.28,55.78 96.28,57.05 79.14,64.03 88.66,72.92 96.92,82.45 87.39,92.61 75.33,97.69 60.72,97.69 42.3,97.69 21.35,97.69 16.27,93.25 21.35,83.72 13.73,78 20.71,71.66 44.84,71.66 74.69,46.26 35.95,76.1 35.32,79.28 53.45,15.94 54.72,15.94 59.8,19.75 59.8,18.48 59.8,17.2 59.8,15.94 59.8,14.66 59.8,13.39 64.25,14.03 64.25,15.3 64.25,12.76 58.53,9.59 64.25,9.59 69.96,9.59 69.96,17.84 72.5,17.84 74.41,21.02 73.14,19.75 80.12,22.29 81.39,17.2 77.58,13.39 81.39,12.76 76.31,26.73 86.47,15.94 86.47,17.2 87.74,17.2 87.74,15.94 74.41,38.16 81.39,39.43 90.92,40.7 90.92,25.46 79.48,7.68 81.39,7.68 82.03,5.78 78.85,5.78 45.83,14.03 47.1,10.22 49.01,7.68 49.64,17.2 45.2,16.57 40.75,11.49 33.13,11.49 31.23,7.68 30.59,17.84 32.49,17.84 26.14,19.75 26.14,5.78 20.43,14.03 14.08,13.39 14.71,23.55 10.27,23.55 36.94,26.73 33.77,26.09 40.75,28 21.7,21.02 17.25,31.81 17.25,29.27 17.25,26.73 17.25,34.98 9,36.26 10.27,34.98 9.63,18.48 8.37,18.48 45.83,7.04 73.14,5.14 59.16,90.23 59.8,83.25 66.78,81.97 66.78,89.59 76.94,87.06 71.86,81.97 42.02,92.77 45.83,92.77 45.83,88.96 42.02,88.96 43.92,90.86 37.58,86.42
  pour Top (isolate 0.61): 0,0 100,0 100,100 0,100
  pour Bottom (isolate 0.61): 0,0 100,0 100,100 0,100
LCD_A
  Top 1.1: D1.C 81.6,43.18 82.87,41.91 SV1.20 | 81.43,58.89 D1.C | R8.1 D1.C
LCD_CONTR
  Top 0.66: SV1.3 85.41,20.32 80.96,20.32 78.42,17.78 R1.S
LCD_CS1  (via drill 0.2)
  Top 0.305: U1.15 58.47,22.59 v58.42,22.54
  Bottom 0.305: SV1.16 68.58,21.27 59.05,21.27 58.42,21.91 v58.42,22.54
LCD_CS2  (via drill 0.2)
  Top 0.305: U1.16 58.97,22.95 v59.05,22.86
  Bottom 0.305: SV1.17 85.41,38.1 83.82,38.1 67.63,21.91 59.37,21.91 59.05,22.23 v59.05,22.86
LCD_CS3  (via drill 0.2)
  Top 0.305: U1.17 59.47,23.4 59.69,23.18 v59.69,22.54
  Bottom 0.305: SV1.18 67.31,22.54 v59.69,22.54
LCD_DB0
  Top 0.305: U1.38 76.83,32.07 82.23,26.67 SV1.8
LCD_DB1
  Top 0.305: U1.39 78.24,32.57 82.87,27.94 85.41,27.94 SV1.9
LCD_DB2
  Top 0.305: U1.40 79.01,33.07 82.87,29.21 SV1.10
LCD_DB3
  Top 0.305: U1.41 80.42,33.57 83.5,30.48 85.41,30.48 SV1.11
LCD_DB4
  Top 0.305: U1.42 81.82,34.07 SV1.12
LCD_DB5
  Top 0.305: U1.43 81.95,34.57 83.5,33.02 85.41,33.02 SV1.13
LCD_DB6
  Top 0.305: U1.44 83.36,35.07 SV1.14
LCD_DB7
  Top 0.305: U1.45 85.42,35.57 SV1.15
LCD_E
  Top 0.305: U1.37 76.06,31.57 82.23,25.4 85.41,25.4 SV1.7
LCD_K
  Top 1.1: SV1.21 87.95,44.45 89.22,45.72 D1.A Q3.D
LCD_PWM  (via drill 0.2)
  Top 0.305: U1.59 59.47,61.69 v59.69,61.91 | v65.09,61.91 R19.2
  Bottom 0.305: v59.69,61.91 v65.09,61.91
LCD_RES
  Top 0.305: U1.46 81.79,36.07 83.82,38.1 84.77,38.1 85.41,38.73 85.41,40.64 SV1.19
LCD_RS
  Top 0.305: U1.35 74.53,30.57 82.23,22.86 85.41,22.86 SV1.5
LCD_RW
  Top 0.305: U1.36 75.3,31.07 82.23,24.13 SV1.6
LED_0
  Top 0.305: U1.77 47.84,37.57 31.11,54.29 R37.1
LED_1
  Top 0.305: U1.78 44.53,37.07 31.11,50.48 R35.1
LED_2
  Top 0.305: U1.79 41.22,36.57 31.11,46.67 R33.1
LED_3
  Top 0.305: U1.80 37.91,36.07 31.11,42.86 R31.1
LED_4
  Top 0.305: U1.81 34.6,35.57 31.11,39.05 R29.1
LED_5
  Top 0.305: U1.82 30.02,35.07 R27.1
N$2
  Top 0.305: Q3.G 89.22,61.59 | 89.22,61.59 86.99,61.59 R19.1 | R20.1 89.22,61.6 89.22,61.59
N$4
  Top 0.66: SV4.6 SV4.8 SV4.10 L4.1 27.62,92.39 C15.1
N$5
  Top 0.66: SV4.5 SV4.7 SV4.9 L5.1 30.16,92.39 C19.2
N$6
  Top 0.66: SV5.10 SV5.9 L6.1 55.56,92.39 C20.2
N$7
  Top 0.66: SV1.2 L1.1 84.46,10.47 C1.2
N$8
  Top 0.66: SV2.10 SV2.9 L2.2 80.96,92.39 C7.2
N$13
  Top 0.305: R49.2 36.83,15.55 L3.1
  Top 0.66: SV3.5 L3.1 31.75,13.97 C9.2
N$24
  Top 0.305: U1.48 70.41,37.07 70.8,37.47 C31.1
N$25
  Top 0.305: U1.73 52.47,43.1 C33.1
N$28
  Top 0.66: T3.1 27.63,34.93 R27.2
N$29
  Top 0.66: R28.1 20,39.05 21.91,37.15 21.91,36.05 T3.3
N$30
  Top 0.66: R28.2 JP3.1
N$31
  Top 0.66: JP3.3 R30.2
N$32
  Top 0.66: T4.1 27.63,38.74 R29.2
N$33
  Top 0.66: R30.1 21.27,41.59 21.91,40.96 21.91,39.86 T4.3
N$34
  Top 0.66: R32.2 JP3.5
N$35
  Top 0.66: T5.1 27.63,42.55 R31.2
N$36
  Top 0.66: R32.1 21.44,44.13 T5.3
N$37
  Top 0.66: JP3.7 R34.2
N$38
  Top 0.66: T6.1 27.63,46.36 R33.2
N$39
  Top 0.66: R34.1 21.44,46.67 T6.3
N$40
  Top 0.66: R36.2 JP3.9
N$41
  Top 0.66: T7.1 27.63,50.17 R35.2
N$42
  Top 0.66: R36.1 21.27,49.21 21.91,49.85 21.91,50.95 T7.3
N$43
  Top 0.66: JP3.11 R38.2
N$44
  Top 0.66: T8.1 27.63,53.98 R37.2
N$46
  Top 0.66: R38.1 20,51.75 21.91,53.66 21.91,54.76 T8.3
N$47
  Top 0.305: U1.1 51.47,23.53 49.85,21.91 47.62,21.91 TP7.TP
N$48
  Top 0.66: R46.1 JP7.3 R45.1
N$49
  Top 0.66: R47.1 JP7.1 R44.1
N$50
  Top 0.305: U1.2 51.97,22.76 TP8.TP
NRST
  Top 0.305: R48.1 50.16,53.66 48.9,52.39 JP4.2 48.9,40.64 57.97,31.57 U1.14
OSC_IN
  Top 0.305: U1.12 56.97,20.45 OS1.3
RX_CS  (via drill 0.2)
  Top 0.305: U1.32 69.99,29.07 v70.48,28.57 | SV2.5 79.69,76.2 70.8,76.2 v70.48,75.88
  Bottom 0.305: v70.48,75.88 v70.48,28.57
RX_MISO  (via drill 0.2)
  Top 0.305: U1.30 68.45,28.07 v69.22,27.3 | SV2.3 79.69,71.12 69.53,71.12 v69.22,71.44
  Bottom 0.305: v69.22,71.44 v69.22,27.3
RX_MOSI  (via drill 0.2)
  Top 0.305: U1.31 69.22,28.57 v69.85,27.94 | SV2.6 70.17,74.93 v69.85,74.61
  Bottom 0.305: v69.85,74.61 v69.85,27.94
RX_NIRQ  (via drill 0.2)
  Top 0.305: U1.33 70.76,29.57 v71.12,29.21 | SV2.1 79.06,67.94 71.44,67.94 v71.12,68.26
  Bottom 0.305: v71.12,68.26 v71.12,29.21
RX_SCK  (via drill 0.2)
  Top 0.305: U1.29 67.68,27.57 v68.58,26.67 | v68.58,72.39 SV2.4
  Bottom 0.305: v68.58,72.39 v68.58,26.67
RX_SDN  (via drill 0.2)
  Top 0.305: U1.34 71.53,30.07 v71.75,29.84 | SV2.8 72.07,77.47 v71.75,77.15
  Bottom 0.305: v71.75,77.15 v71.75,29.84
SWCLK  (via drill 0.2)
  Top 0.305: U1.76 48.61,38.07 v47.94,38.73 | JP4.3 51.44,46.99 50.16,45.72 v50.16,40.96
  Bottom 0.305: v50.16,40.96 v47.94,38.73
SWDIO
  Top 0.305: U1.72 52.97,41.54 53.98,42.55 JP4.4
TAMPER
  Top 0.305: U1.5 53.47,22.99 51.75,21.27 R43.2 | JP6.1 51.44,13.65 R43.2 | C35.1 R43.2
TX_CS  (via drill 0.2)
  Top 0.305: U1.55 61.47,74.42 v61.28,74.61
  Bottom 0.305: SV5.5 60.96,74.93 v61.28,74.61
TX_MISO  (via drill 0.2)
  Top 0.305: U1.53 62.47,68.82 63.5,69.85 v63.5,72.39
  Bottom 0.305: SV5.3 v63.5,72.39
TX_MOSI  (via drill 0.2)
  Top 0.305: U1.54 61.97,69.27 62.55,69.85 v62.55,73.66
  Bottom 0.305: SV5.6 54.29,73.66 v62.55,73.66
TX_NIRQ
  Top 0.305: SV5.1 60.64,69.85 60.97,69.53 U1.56
TX_SCK  (via drill 0.2)
  Top 0.305: U1.52 62.97,68.36 64.45,69.85 v64.45,71.12
  Bottom 0.305: SV5.4 54.29,71.12 v64.45,71.12
TX_SDN  (via drill 0.2)
  Top 0.305: U1.51 63.47,67.91 v65.41,69.85
  Bottom 0.305: SV5.8 54.29,76.2 61.28,76.2 65.41,72.07 v65.41,69.85
VDDA
  Top 0.305: U1.21 61.47,22.67 63.5,20.64 64.77,20.64 C23.1 66.36,20.64 66.67,20.32 66.67,15.97 L8.2
VREF
  Top 0.305: L7.2 62.64,15.65 63.18,16.19 63.18,20 62.55,20.64 C24.1 61.59,21.59 60.97,22.22 U1.20

### Text on the board
tDocu: FREQ_REFERENCE | TX_BOARD | RX_BOARD | GND | GND | 3V3 | 5V | LEDs | SWD | LCD_CONNECTOR | KEYBOARD | LCD_CONTR | TP7 8 | ENCODER | FRONT_SPK/MIC | TAMPER